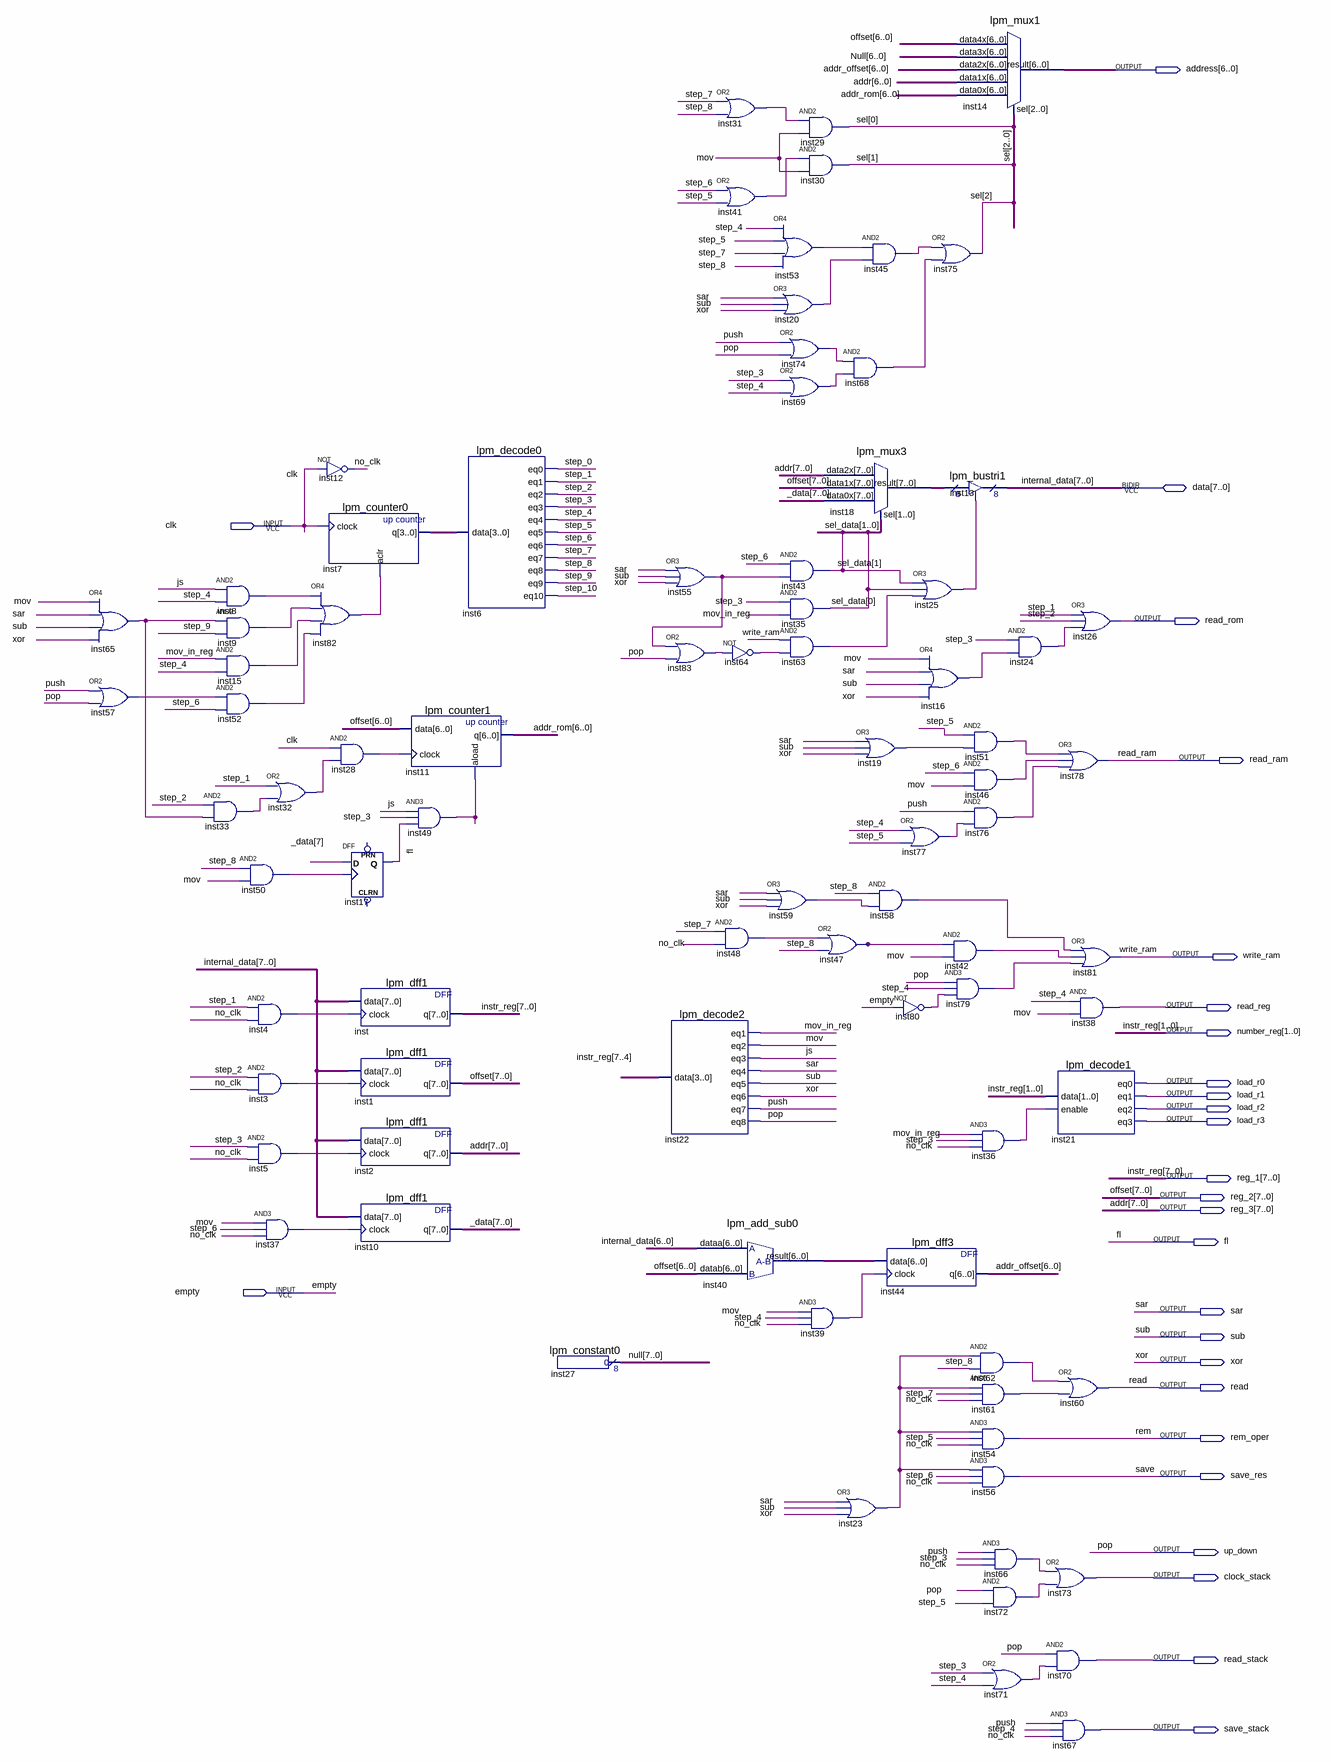
[diagram p0: schematic sheet]
// Quartus schematic cpu.bdf as structural Verilog: 83 symbols, 27 pins
module cpu (
  input  clk,
  input  empty,
  inout  [7:0] data,
  output [6:0] address,
  output read_rom,
  output read_ram,
  output write_ram,
  output read_reg,
  output [1:0] number_reg,
  output load_r0,
  output load_r1,
  output load_r2,
  output load_r3,
  output [7:0] reg_1,
  output [7:0] reg_2,
  output [7:0] reg_3,
  output fl,
  output sar,
  output sub,
  output \xor ,
  output read,
  output rem_oper,
  output save_res,
  output up_down,
  output clock_stack,
  output read_stack,
  output save_stack
);

  wire inst3_out, inst4_out, inst5_out, inst8_out, inst9_out, inst15_out, inst16_out, inst19_out, inst20_out,
       inst23_out, inst24_out, inst25_out, inst28_out, inst31_out, inst32_out, inst33_out, inst36_out,
       inst37_out, inst39_out, inst41_out, inst42_out, inst45_out, inst46_out, inst47_out, inst48_out,
       inst49_out, inst50_out, inst51_out, inst52_out, inst53_out, inst55_out, inst57_out, inst58_out,
       inst59_out, inst61_out, inst62_out, inst63_out, inst64_out, inst65_out, inst66_out, inst68_out,
       inst69_out, inst71_out, inst72_out, inst74_out, inst76_out, inst77_out, inst79_out, inst80_out,
       inst82_out, inst83_out, js, mov, mov_in_reg, no_clk, push, step_0, step_1, step_2, step_3, step_4,
       step_5, step_6, step_7, step_8, step_9, step_10;
  wire [1:0] sel_data;
  wire [2:0] sel;
  wire [3:0] inst7_q;
  wire [6:0] addr_offset, addr_rom, inst40_result;
  wire [7:0] _data, inst18_result, \null ;

  or inst65 (inst65_out, mov, sar, sub, \xor );
  or inst57 (inst57_out, push, up_down);
  and inst33 (inst33_out, step_2, inst65_out);
  and inst8 (inst8_out, js, step_4);
  and inst9 (inst9_out, inst65_out, step_9);
  and inst15 (inst15_out, mov_in_reg, step_4);
  and inst52 (inst52_out, inst57_out, step_6);
  and inst50 (inst50_out, step_8, mov);
  and inst4 (inst4_out, step_1, no_clk);
  and inst3 (inst3_out, step_2, no_clk);
  and inst5 (inst5_out, step_3, no_clk);
  and inst37 (inst37_out, mov, step_6, no_clk);
  or inst82 (inst82_out, inst8_out, inst9_out, inst15_out, inst52_out);
  or inst32 (inst32_out, step_1, inst33_out);
  not inst12 (no_clk, clk);
  lpm_counter0 inst7 (.clock(clk), .aclr(inst82_out), .q(inst7_q));
  and inst28 (inst28_out, clk, inst32_out);
  DFF inst17 (.CLK(inst50_out), .D(_data[7]), .Q(fl));  // open: CLRN, PRN
  lpm_dff1 inst (.data(data), .clock(inst4_out), .q({reg_1[7:2], number_reg}));
  lpm_dff1 inst1 (.data(data), .clock(inst3_out), .q(reg_2));
  lpm_dff1 inst2 (.data(data), .clock(inst5_out), .q(reg_3));
  lpm_dff1 inst10 (.data(data), .clock(inst37_out), .q(_data));
  lpm_counter1 inst11 (.data(reg_2[6:0]), .clock(inst28_out), .aload(inst49_out), .q(addr_rom));
  and inst49 (inst49_out, js, step_3, fl);
  lpm_decode0 inst6 (
    .data(inst7_q), .eq0(step_0), .eq1(step_1), .eq2(step_2), .eq3(step_3), .eq4(step_4), .eq5(step_5),
    .eq6(step_6), .eq7(step_7), .eq8(step_8), .eq9(step_9), .eq10(step_10));
  lpm_constant0 inst27 (.result(\null ));
  or inst55 (inst55_out, sar, sub, \xor );
  or inst83 (inst83_out, inst55_out, up_down);
  lpm_decode2 inst22 (
    .data(reg_1[7:4]), .eq1(mov_in_reg), .eq2(mov), .eq3(js), .eq4(sar), .eq5(sub), .eq6(\xor ), .eq7(push),
    .eq8(up_down));
  or inst31 (inst31_out, step_7, step_8);
  or inst41 (inst41_out, step_6, step_5);
  and inst48 (inst48_out, step_7, no_clk);
  lpm_add_sub0 inst40 (.dataa(data[6:0]), .datab(reg_2[6:0]), .result(inst40_result));
  not inst64 (inst64_out, inst83_out);
  or inst59 (inst59_out, sar, sub, \xor );
  and inst29 (sel[0], inst31_out, mov);
  and inst30 (sel[1], inst41_out, mov);
  or inst53 (inst53_out, step_4, step_5, step_7, step_8);
  or inst20 (inst20_out, sar, sub, \xor );
  or inst74 (inst74_out, push, up_down);
  or inst69 (inst69_out, step_3, step_4);
  and inst43 (sel_data[1], step_6, inst55_out);
  and inst35 (sel_data[0], step_3, mov_in_reg);
  and inst63 (inst63_out, write_ram, inst64_out);
  or inst47 (inst47_out, inst48_out, step_8);
  and inst39 (inst39_out, mov, step_4, no_clk);
  and inst45 (inst45_out, inst53_out, inst20_out);
  and inst68 (inst68_out, inst74_out, inst69_out);
  lpm_mux3 inst18 (.data2x(reg_3), .data1x(reg_2), .data0x(_data), .sel(sel_data), .result(inst18_result));
  or inst19 (inst19_out, sar, sub, \xor );
  and inst58 (inst58_out, step_8, inst59_out);
  or inst23 (inst23_out, sar, sub, \xor );
  or inst25 (inst25_out, sel_data[1], sel_data[0], inst63_out);
  or inst16 (inst16_out, mov, sar, sub, \xor );
  or inst77 (inst77_out, step_4, step_5);
  not inst80 (inst80_out, empty);
  lpm_dff3 inst44 (.data(inst40_result), .clock(inst39_out), .q(addr_offset));
  lpm_mux1 inst14 (
    .data4x(reg_2[6:0]), .data3x(\null [6:0]), .data2x(addr_offset), .data1x(reg_3[6:0]), .data0x(addr_rom),
    .sel(sel), .result(address));
  or inst75 (sel[2], inst45_out, inst68_out);
  lpm_bustri1 inst13 (.enabledt(inst25_out), .data(inst18_result), .tridata(data));
  and inst51 (inst51_out, step_5, inst19_out);
  and inst46 (inst46_out, step_6, mov);
  and inst76 (inst76_out, push, inst77_out);
  and inst42 (inst42_out, inst47_out, mov);
  and inst79 (inst79_out, up_down, step_4, inst80_out);
  and inst36 (inst36_out, mov_in_reg, step_3, no_clk);
  and inst62 (inst62_out, inst23_out, step_8);
  and inst61 (inst61_out, inst23_out, step_7, no_clk);
  and inst54 (rem_oper, inst23_out, step_5, no_clk);
  and inst56 (save_res, inst23_out, step_6, no_clk);
  and inst24 (inst24_out, step_3, inst16_out);
  and inst66 (inst66_out, push, step_3, no_clk);
  and inst72 (inst72_out, up_down, step_5);
  or inst71 (inst71_out, step_3, step_4);
  or inst26 (read_rom, step_1, step_2, inst24_out);
  or inst78 (read_ram, inst51_out, inst46_out, inst76_out);
  or inst81 (write_ram, inst58_out, inst42_out, inst79_out);
  and inst38 (read_reg, step_4, mov);
  lpm_decode1 inst21 (
    .data(number_reg), .enable(inst36_out), .eq0(load_r0), .eq1(load_r1), .eq2(load_r2), .eq3(load_r3));
  or inst60 (read, inst62_out, inst61_out);
  or inst73 (clock_stack, inst66_out, inst72_out);
  and inst70 (read_stack, up_down, inst71_out);
  and inst67 (save_stack, push, step_4, no_clk);

  assign reg_1[1:0] = number_reg;

  // Other names for the same wires on the sheet: addr[7:0] = reg_3; instr_reg[7:0] = {reg_1[7:2], number_reg};
  //   internal_data[7:0] = data; offset[7:0] = reg_2; pop = up_down; rem = rem_oper; save = save_res
endmodule
